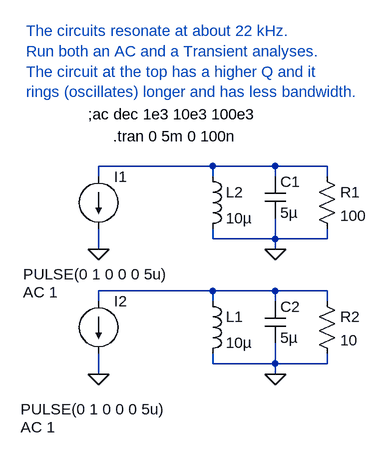
[diagram p0: schematic Ringing.asc]
Ringing.asc, the LTspice schematic file:
Version 4
SHEET 1 880 680
WIRE 128 0 -48 0
WIRE 224 0 128 0
WIRE 304 0 224 0
WIRE -48 16 -48 0
WIRE 128 16 128 0
WIRE 224 16 224 0
WIRE 304 16 304 0
WIRE 128 112 128 96
WIRE 224 112 224 80
WIRE 224 112 128 112
WIRE 304 112 304 96
WIRE 304 112 224 112
WIRE -48 128 -48 96
WIRE 224 128 224 112
WIRE 128 192 -48 192
WIRE 224 192 128 192
WIRE 304 192 224 192
WIRE -48 208 -48 192
WIRE 128 208 128 192
WIRE 224 208 224 192
WIRE 304 208 304 192
WIRE 128 304 128 288
WIRE 224 304 224 272
WIRE 224 304 128 304
WIRE 304 304 304 288
WIRE 304 304 224 304
WIRE -48 320 -48 288
WIRE 224 320 224 304
FLAG 224 128 0
FLAG 224 320 0
FLAG -48 128 0
FLAG -48 320 0
SYMBOL ind 112 192 R0
SYMATTR InstName L1
SYMATTR Value 10µ
SYMBOL ind 112 0 R0
SYMATTR InstName L2
SYMATTR Value 10µ
SYMBOL cap 208 16 R0
SYMATTR InstName C1
SYMATTR Value 5µ
SYMBOL cap 208 208 R0
SYMATTR InstName C2
SYMATTR Value 5µ
SYMBOL res 288 0 R0
SYMATTR InstName R1
SYMATTR Value 100
SYMBOL res 288 192 R0
SYMATTR InstName R2
SYMATTR Value 10
SYMBOL current -48 16 R0
WINDOW 3 -116 150 Left 0
WINDOW 123 -116 178 Left 0
WINDOW 39 0 0 Left 0
SYMATTR InstName I1
SYMATTR Value PULSE(0 1 0 0 0 5u)
SYMATTR Value2 AC 1
SYMBOL current -48 208 R0
WINDOW 3 -120 166 Left 0
WINDOW 123 -120 194 Left 0
WINDOW 39 0 0 Left 0
SYMATTR InstName I2
SYMATTR Value PULSE(0 1 0 0 0 5u)
SYMATTR Value2 AC 1
TEXT -26 -46 Left 0 !.tran 0 5m 0 100n
TEXT -64 -80 Left 0 !;ac dec 1e3 10e3 100e3
TEXT -160 -208 Left 0 ;The circuits resonate at about 22 kHz.\nRun both an AC and a Transient analyses.\nThe circuit at the top has a higher Q and it\nrings (oscillates) longer and has less bandwidth.

The netlist it stands for:
* Ringing.asc
L1 N002 0 10µ
L2 N001 0 10µ
C1 N001 0 5µ
C2 N002 0 5µ
R1 N001 0 100
R2 N002 0 10
I1 N001 0 PULSE(0 1 0 0 0 5u) AC 1
I2 N002 0 PULSE(0 1 0 0 0 5u) AC 1
.tran 0 5m 0 100n
;ac dec 1e3 10e3 100e3
* The circuits resonate at about 22 kHz.
* Run both an AC and a Transient analyses.
* The circuit at the top has a higher Q and it
* rings (oscillates) longer and has less bandwidth.
.backanno
.end